# Altium project Receiver.PrjPcb (part 2 of 3)

## Sheet USB_Ethernet.SchDoc: USB & Ethernet
size A4; DrawnBy: Patrik Staudenmayer; DocumentNumber: 5; SheetNumber: 5; SheetTotal: 15
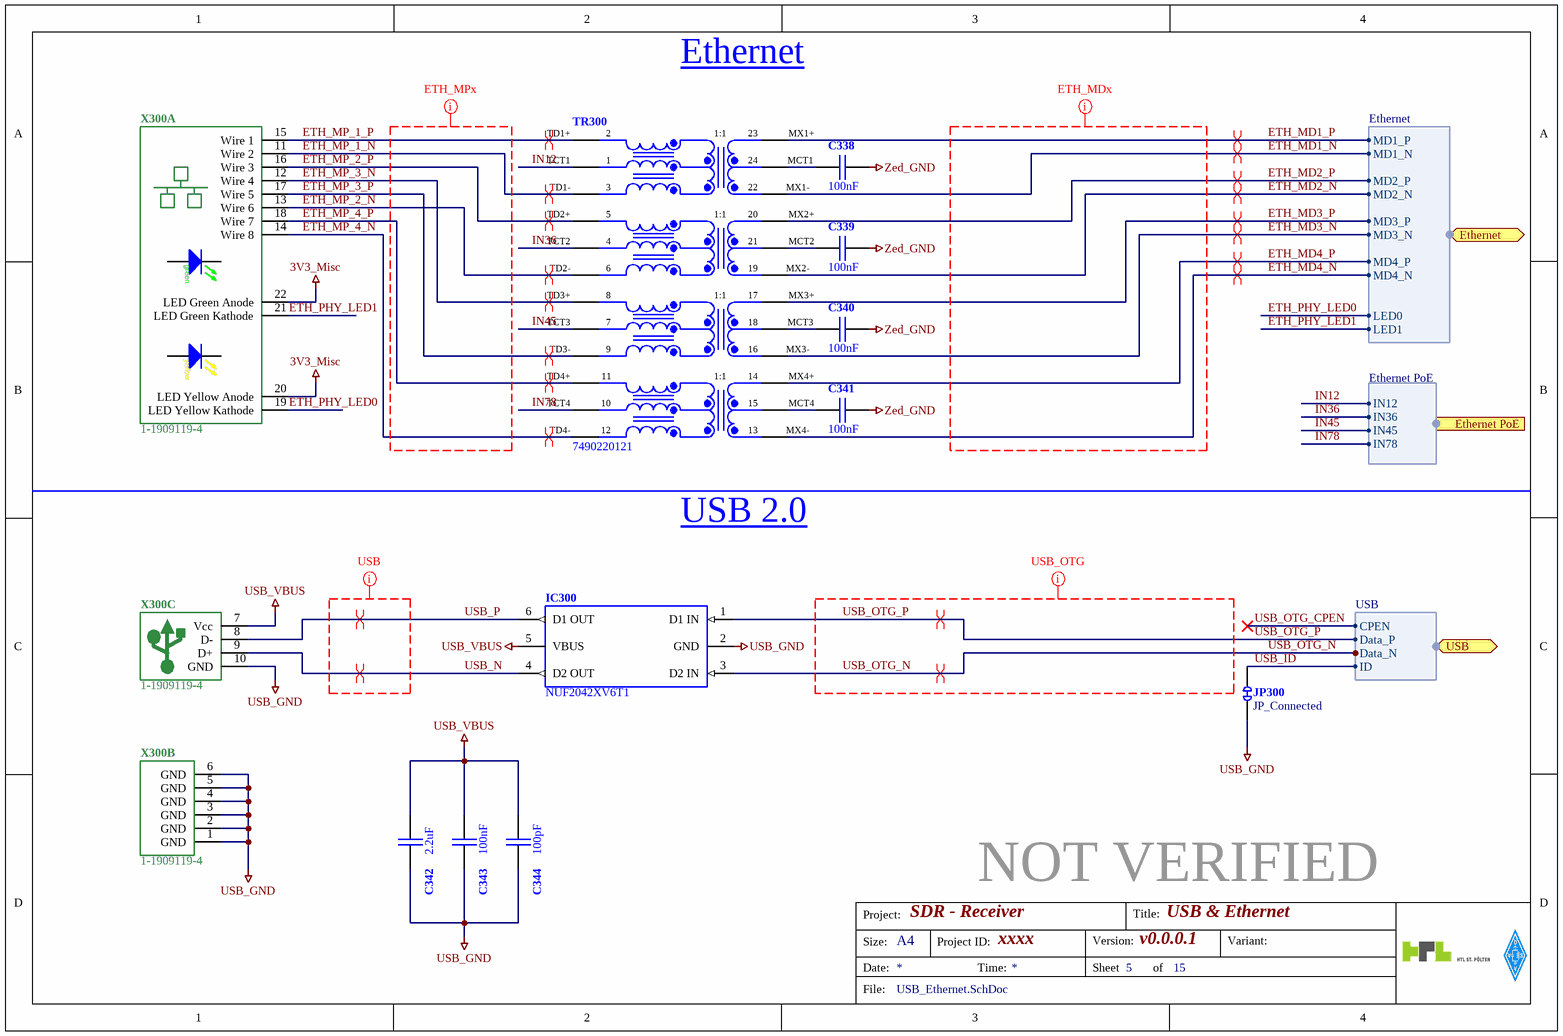
[diagram p6: USB_Ethernet.SchDoc]

### Parts
C338  100nF  [C_0603_N [CAPC1608N IPC]]
C339  100nF  [C_0603_N [CAPC1608N IPC]]
C340  100nF  [C_0603_N [CAPC1608N IPC]]
C341  100nF  [C_0603_N [CAPC1608N IPC]]
C342  2.2uF  [C_1210_N [CAPC3225N IPC]]
C343  100nF  [C_0805_N [CAPC2013N IPC]]
C344  100pF  [C_0603_N [CAPC1608N IPC]]
IC300  NUF2042XV6T1  [SOTFL50P160X60-6N IPC]
JP300  JP_Connected  [JP_Connected]  (no BOM)
TR300  7490220121  [TR_7490220121]
X300  1-1909119-4  [X_1-1909119-4]  (parts A,B,C of 3)

### Ports
Ethernet (bidir, harness Ethernet), Ethernet PoE (harness Ethernet PoE), USB (bidir, harness USB)

### Harnesses
Ethernet: LED0, LED1, MD1_P, MD1_N, MD2_P, MD2_N, MD3_P, MD3_N, MD4_P, MD4_N
Ethernet PoE: IN12, IN36, IN45, IN78
USB: ID, Data_P, Data_N, CPEN

### Nets
3V3_Misc: X300.20(LED_Yellow_Anode) X300.22(LED_Green_Anode)
USB_GND: C338.2 C339.2 C340.2 C341.2 C342.2 C343.2 C344.2 IC300.2(GND) JP300.2(-) X300.1(GND) X300.2(GND) X300.3(GND) X300.4(GND) X300.5(GND) X300.6(GND) X300.10(GND)  [also labelled Zed_GND]  [project net Con_GND]
USB_VBUS: C342.1 C343.1 C344.1 IC300.5(VBUS) X300.7(Vcc)
ETH_MD1_N: TR300.22(MX1-) ; port Ethernet.MD1_N
ETH_MD1_P: TR300.23(MX1+) ; port Ethernet.MD1_P
ETH_MD2_N: TR300.19(MX2-) ; port Ethernet.MD2_N
ETH_MD2_P: TR300.20(MX2+) ; port Ethernet.MD2_P
ETH_MD3_N: TR300.16(MX3-) ; port Ethernet.MD3_N
ETH_MD3_P: TR300.17(MX3+) ; port Ethernet.MD3_P
ETH_MD4_N: TR300.13(MX4-) ; port Ethernet.MD4_N
ETH_MD4_P: TR300.14(MX4+) ; port Ethernet.MD4_P
ETH_MP_1_N: TR300.3(TD1-) X300.11(Wire_2)
ETH_MP_1_P: TR300.2(TD1+) X300.15(Wire_1)
ETH_MP_2_N: TR300.6(TD2-) X300.13(Wire_6)
ETH_MP_2_P: TR300.5(TD2+) X300.16(Wire_3)
ETH_MP_3_N: TR300.8(TD3+) X300.12(Wire_4)
ETH_MP_3_P: TR300.9(TD3-) X300.17(Wire_5)
ETH_MP_4_N: TR300.12(TD4-) X300.14(Wire_8)
ETH_MP_4_P: TR300.11(TD4+) X300.18(Wire_7)
ETH_PHY_LED0: X300.19(LED_Yellow_Kathode) ; port Ethernet.LED0
ETH_PHY_LED1: X300.21(LED_Green_Kathode) ; port Ethernet.LED1
IN12: TR300.1(TCT1) ; port Ethernet PoE.IN12
IN36: TR300.4(TCT2) ; port Ethernet PoE.IN36
IN45: TR300.7(TCT3) ; port Ethernet PoE.IN45
IN78: TR300.10(TCT4) ; port Ethernet PoE.IN78
USB_ID: JP300.1(+) ; port USB.ID
USB_N: IC300.4(D2_OUT) X300.9(D+)
USB_OTG_CPEN: port USB.CPEN
USB_OTG_N: IC300.3(D2_IN) ; port USB.Data_N
USB_OTG_P: IC300.1(D1_IN) ; port USB.Data_P
USB_P: IC300.6(D1_OUT) X300.8(D-)
NetC338_1: C338.1 TR300.24(MCT1)
NetC339_1: C339.1 TR300.21(MCT2)
NetC340_1: C340.1 TR300.18(MCT3)
NetC341_1: C341.1 TR300.15(MCT4)

### Layout directives
differential pair: ETH_MD1_N, ETH_MD1_P, ETH_MD2_N, ETH_MD2_P, ETH_MD3_N, ETH_MD3_P, ETH_MD4_N, ETH_MD4_P, ETH_MP_1_N, ETH_MP_1_P, ETH_MP_2_N, ETH_MP_2_P, ETH_MP_3_N, ETH_MP_3_P, ETH_MP_4_N, ETH_MP_4_P, USB_N, USB_OTG_N, USB_OTG_P, USB_P
net class ETH_MDx; rule Matched Net Lengths [Tolerance = 25mil]; rule Maximum Via Count Constraint [Max Count = 2]; rule Differential Pairs Routing [Pref Gap = 5mil    Min Gap  = 5mil    Max Gap  = 5milPref Width = 4.138mil    Min Width  = 2.925mil    Max Width  = 4.138mil]: (no net found under the mark)
net class ETH_MPx; rule Matched Net Lengths [Tolerance = 25mil]; rule Maximum Via Count Constraint [Max Count = 2]; rule Differential Pairs Routing [Pref Gap = 5mil    Min Gap  = 5mil    Max Gap  = 5milPref Width = 4.138mil    Min Width  = 2.925mil    Max Width  = 4.138mil]: (no net found under the mark)
net class USB; rule Differential Pairs Routing [Pref Gap = 5mil    Min Gap  = 5mil    Max Gap  = 5milPref Width = 5.458mil    Min Width  = 3.981mil    Max Width  = 5.458mil]; rule Matched Net Lengths [Tolerance = 25mil]; rule Maximum Via Count Constraint [Max Count = 2]: (no net found under the mark)
net class USB_OTG; rule Differential Pairs Routing [Pref Gap = 5mil    Min Gap  = 5mil    Max Gap  = 5milPref Width = 5.458mil    Min Width  = 3.981mil    Max Width  = 5.458mil]; rule Matched Net Lengths [Tolerance = 25mil]; rule Maximum Via Count Constraint [Max Count = 2]: USB_OTG_N, USB_OTG_P

### Notes on the sheet
- Ethernet
- USB 2.0
- Project:
- Title:
- Size:
- Date:
- A4
- Project ID:
- Time:
- Sheet
- Version:
- of
- Variant:
- File:
- (in symbol TR_7490220121) 1:1
- (in symbol X_1-1909119-4, part A) green; yellow

### Library data of the parts
C338-C344 = C_GENERIC: Prometheus_ID: *; Prometheus_Manufacturer: *
  C338-C341: Prometheus_ManPartNo: 100nF; Prometheus_Comment: 100nF; Prometheus_CurrentFootprint: C_0603_N [CAPC1608N IPC]
  C342: Prometheus_ManPartNo: 2.2uF; Prometheus_Comment: 2.2uF; Prometheus_CurrentFootprint: C_1210_N [CAPC3225N IPC]
  C343: Prometheus_ManPartNo: 100nF; Prometheus_Comment: 100nF; Prometheus_CurrentFootprint: C_0805_N [CAPC2013N IPC]
  C344: Prometheus_ManPartNo: 100pF; Prometheus_Comment: 100pF; Prometheus_CurrentFootprint: C_0603_N [CAPC1608N IPC]
IC300 = IC_NUF2042XV6T1: USB Upstream Terminator with ESD Protection / Compliance with IEC61000-4-2 (Level 4) / 8 kV (Contact) / 15 kV (Air) / ESD Ratings: / Machine Model = C / Human Body Model = 3B; Prometheus_Manufacturer: ON Semiconductor; Prometheus_ManPartNo: NUF2042XV6T1; Prometheus_Comment: NUF2042XV6T1; Prometheus_CurrentFootprint: SOTFL50P160X60-6N IPC
TR300 = TR_7490220121: Operating temperature: -40°C - +105°C / 1000BaseT according to IEEE 802.3bt / for 4PPoE / 600 mA per center tap / 30 W when using two channels / 60 W when using four channels; Prometheus_Manufacturer: Wuerth; Prometheus_ID: *; Prometheus_ManPartNo: 7490220121; Prometheus_Comment: 7490220121; Prometheus_CurrentFootprint: TR_7490220121
X300 = X_1-1909119-4: Combo Jack RJ45 + USB / Green and Yellow Led; Prometheus_Manufacturer: TE Connectivity; Prometheus_ID: *; Prometheus_ManPartNo: 1-1909119-4; Prometheus_Comment: 1-1909119-4; Prometheus_CurrentFootprint: X_1-1909119-4
JP300 = JP_Connected: Prometheus_ID: *; Prometheus_ManPartNo: JP_Connected; Prometheus_Manufacturer: *; Prometheus_Comment: JP_Connected; Prometheus_CurrentFootprint: JP_Connected

## Sheet SD_Card.SchDoc: SD Card
size A4; DrawnBy: Patrik Staudenmayer; DocumentNumber: 6; SheetNumber: 6; SheetTotal: 15
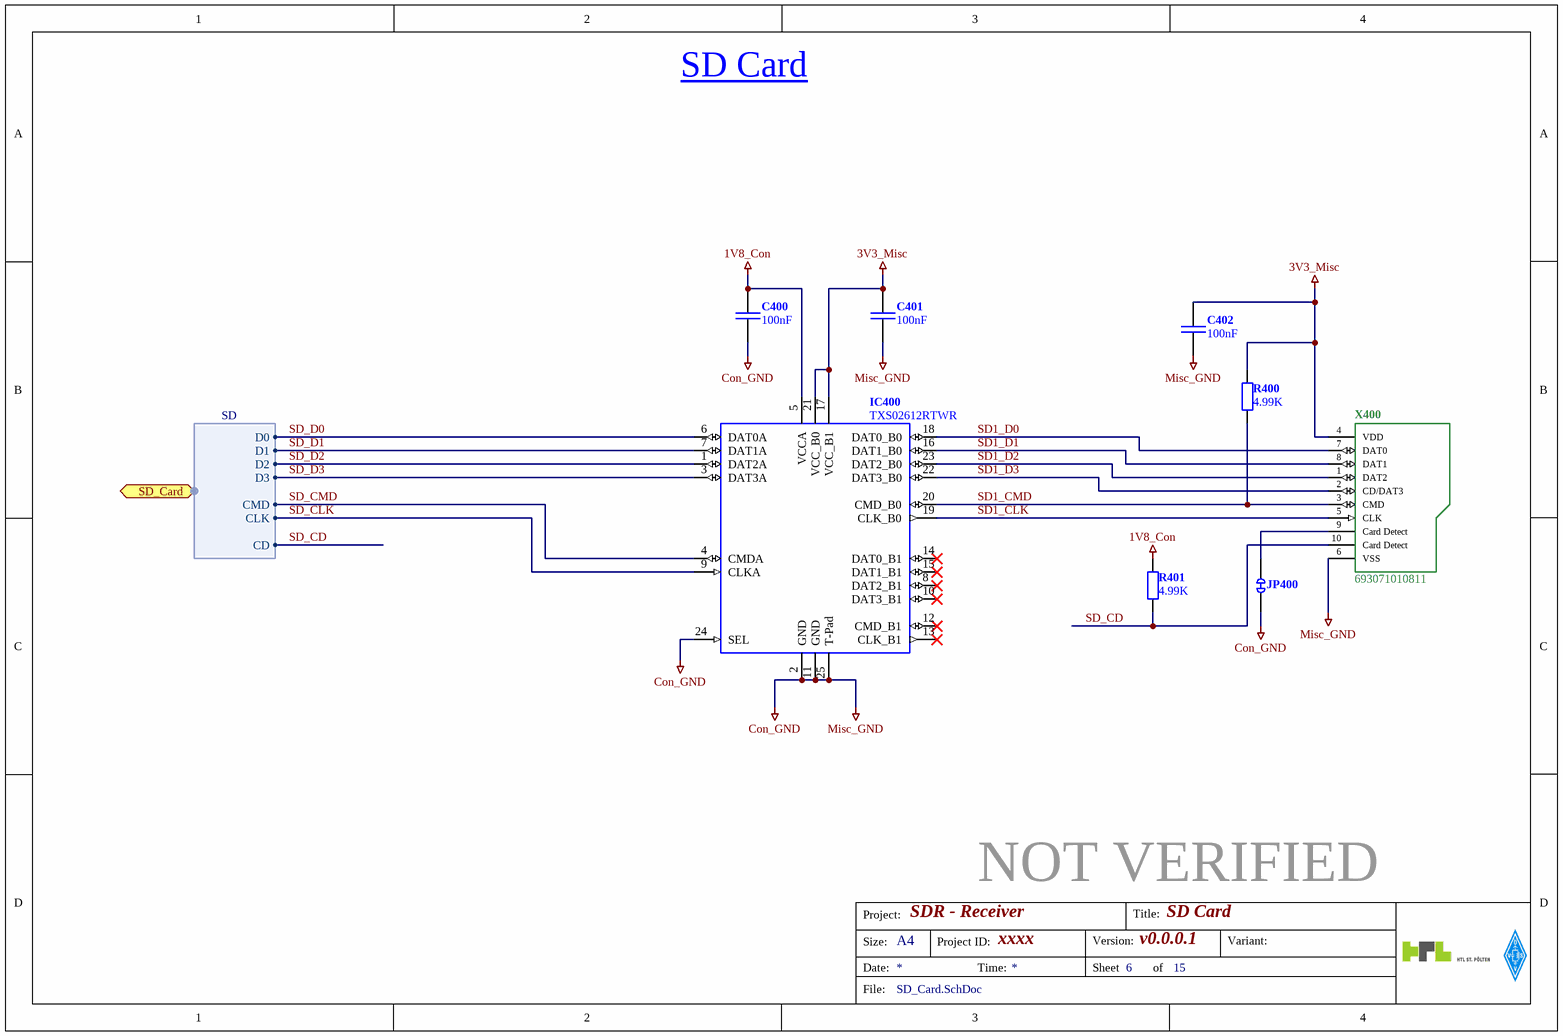
[diagram p7: SD_Card.SchDoc]

### Parts
C400  100nF  [C_0603_N [CAPC1608N IPC]]
C401  100nF  [C_0603_N [CAPC1608N IPC]]
C402  100nF  [C_0603_N [CAPC1608N IPC]]
IC400  TXS02612RTWR  [QFN50P400X400X80_HS-25N IPC]
JP400  JP_Connected  [JP_Connected]  (value not drawn)  (no BOM)
R400  4.99K  [R_0603_N [RESC1608N IPC]]
R401  4.99K  [R_0603_N [RESC1608N IPC]]
X400  693071010811  [X_693071010811]

### Ports
SD_Card (bidir, harness SD)

### Harnesses
SD: CLK, D0, D1, D2, D3, CD, CMD

### Nets
1V8_Con: C400.1 IC400.5(VCCA) R401.2
3V3_Misc: C401.1 C402.1 IC400.17(VCC_B1) IC400.21(VCC_B0) R400.2 X400.4(VDD)
Con_GND: C400.2 C401.2 C402.2 IC400.2(GND) IC400.11(GND) IC400.24(SEL) IC400.25(T-Pad) JP400.2(-) X400.6(VSS)  [also labelled Misc_GND]
SD1_CLK: IC400.19(CLK_B0) X400.5(CLK)
SD1_CMD: IC400.20(CMD_B0) R400.1 X400.3(CMD)
SD1_D0: IC400.18(DAT0_B0) X400.7(DAT0)
SD1_D1: IC400.16(DAT1_B0) X400.8(DAT1)
SD1_D2: IC400.23(DAT2_B0) X400.1(DAT2)
SD1_D3: IC400.22(DAT3_B0) X400.2(CD/DAT3)
SD_CD: R401.1 X400.10(Card_Detect) ; port SD_Card.CD
SD_CLK: IC400.9(CLKA) ; port SD_Card.CLK
SD_CMD: IC400.4(CMDA) ; port SD_Card.CMD
SD_D0: IC400.6(DAT0A) ; port SD_Card.D0
SD_D1: IC400.7(DAT1A) ; port SD_Card.D1
SD_D2: IC400.1(DAT2A) ; port SD_Card.D2
SD_D3: IC400.3(DAT3A) ; port SD_Card.D3
NetJP400_1: JP400.1(+) X400.9(Card_Detect)

Not connected (* = marked no-connect by the designer): IC400 8(DAT2_B1)* 10(DAT3_B1)* 12(CMD_B1)* 13(CLK_B1)* 14(DAT0_B1)* 15(DAT1_B1)*

### Notes on the sheet
- SD Card
- Project:
- Title:
- Size:
- Date:
- A4
- Project ID:
- Time:
- Sheet
- Version:
- of
- Variant:
- File:

### Library data of the parts
C400-C402 = C_GENERIC: Prometheus_ID: *; Prometheus_ManPartNo: 100nF; Prometheus_Manufacturer: *; Prometheus_Comment: 100nF; Prometheus_CurrentFootprint: C_0603_N [CAPC1608N IPC]
IC400 = IC_TXS02612: Prometheus_Manufacturer: Analog Devices; Prometheus_ManPartNo: TXS02612RTWR; Prometheus_Comment: TXS02612RTWR; Prometheus_CurrentFootprint: QFN50P400X400X80_HS-25N IPC
R400 R401 = R_GENERIC_DIN: Prometheus_ID: *; Prometheus_ManPartNo: 4.99K; Prometheus_Manufacturer: *; Prometheus_Comment: 4.99K; Prometheus_CurrentFootprint: R_0603_N [RESC1608N IPC]
X400 = X_693071010811: WR-CRD Micro SD Card Connector, Push & Push, with card detection; Prometheus_Manufacturer: Wuerth Electronics; Prometheus_ID: *; Prometheus_ManPartNo: 693071010811; Prometheus_Comment: 693071010811; Prometheus_CurrentFootprint: X_693071010811
JP400 = JP_Connected: Prometheus_ID: *; Prometheus_ManPartNo: JP_Connected; Prometheus_Manufacturer: *; Prometheus_Comment: JP_Connected; Prometheus_CurrentFootprint: JP_Connected

## Sheet UART_JTAG.SchDoc: UART & JTAG
size A4; DrawnBy: Patrik Staudenmayer; DocumentNumber: 7; SheetNumber: 7; SheetTotal: 15
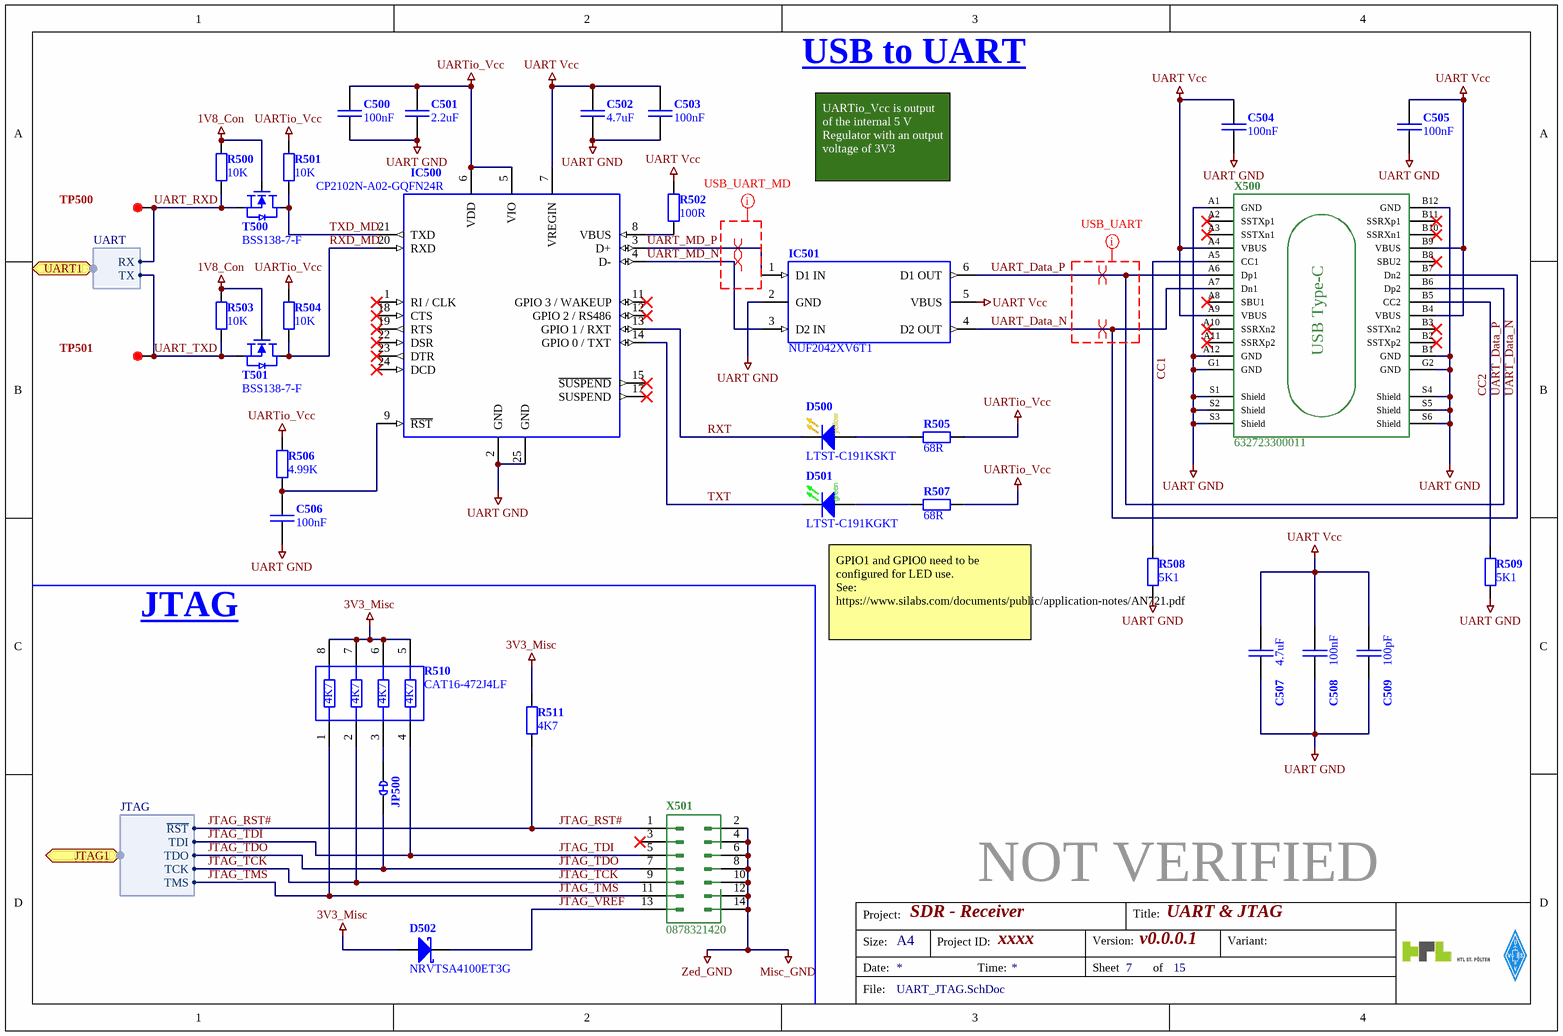
[diagram p8: UART_JTAG.SchDoc]

### Parts
C500  100nF  [C_0603_N [CAPC1608N IPC]]
C501  2.2uF  [C_0805_N [CAPC2013N IPC]]
C502  4.7uF  [C_0805_N [CAPC2013N IPC]]
C503  100nF  [C_0603_N [CAPC1608N IPC]]
C504  100nF  [C_0603_N [CAPC1608N IPC]]
C505  100nF  [C_0603_N [CAPC1608N IPC]]
C506  100nF  [C_0603_N [CAPC1608N IPC]]
C507  4.7uF  [C_1210_N [CAPC3225N IPC]]
C508  100nF  [C_0805_N [CAPC2013N IPC]]
C509  100pF  [C_0603_N [CAPC1608N IPC]]
D500  LTST-C191KSKT  [LED_0603-YELLOW_N_AK]
D501  LTST-C191KGKT  [LED_0603-GREEN_N_AK]
D502  NRVTSA4100ET3G  [DIOM4326X22N IPC]
IC500  CP2102N-A02-GQFN24R  [QFN50P400X400X80_HS-25N IPC]
IC501  NUF2042XV6T1  [SOTFL50P160X60-6N IPC]
JP500  JP_Connected  [JP_Connected]  (value not drawn)  (no BOM)
R500  10K  [R_0201_L [RESC0603L IPC]]
R501  10K  [R_0201_L [RESC0603L IPC]]
R502  100R  [R_0603_N [RESC1608N IPC]]
R503  10K  [R_0201_L [RESC0603L IPC]]
R504  10K  [R_0201_L [RESC0603L IPC]]
R505  68R  [R_0603_N [RESC1608N IPC]]
R506  4.99K  [R_0201_L [RESC0603L IPC]]
R507  68R  [R_0603_N [RESC1608N IPC]]
R508  5K1  [R_0603_N [RESC1608N IPC]]
R509  5K1  [R_0603_N [RESC1608N IPC]]
R510  CAT16-472J4LF  [CAC-80P320X155-8N]
R511  4K7  [R_0603_N [RESC1608N IPC]]
T500  BSS138-7-F  [SOT105P235X102-3N IPC]
T501  BSS138-7-F  [SOT105P235X102-3N IPC]
TP500  TP_GENERIC  [TP_0.8_P100T]  (value not drawn)  (no BOM)
TP501  TP_GENERIC  [TP_0.8_P100T]  (value not drawn)  (no BOM)
X500  632723300011  [X_632723300011]
X501  0878321420  [X_SMD_HEADER2x7_P254_H0_Prometheus]

### Ports
JTAG1 (bidir, harness JTAG), UART1 (bidir, harness UART)

### Harnesses
UART: RX, TX
JTAG: TMS, TCK, TDI, TDO, ~{RST}

### Nets
1V8_Con: R500.2 R503.2 T500.G T501.G
3V3_Misc: D502.A R510.5 R510.6 R510.7 R510.8 R511.2
Misc_GND: X501.2 X501.4 X501.6 X501.8 X501.10 X501.12 X501.14  [also labelled Zed_GND]  [project net Con_GND]
UART GND: C500.2 C501.2 C502.2 C503.2 C504.2 C505.2 C506.2 C507.2 C508.2 C509.2 IC500.2(GND) IC500.25(GND) IC501.2(GND) R508.1 R509.1 X500.A1(GND) X500.A12(GND) X500.B1(GND) X500.B12(GND) X500.G1(GND) X500.G2(GND) X500.S1(Shield) X500.S2(Shield) X500.S3(Shield) X500.S4(Shield) X500.S5(Shield) X500.S6(Shield)
UART Vcc: C502.1 C503.1 C504.1 C505.1 C507.1 C508.1 C509.1 IC500.7(VREGIN) IC501.5(VBUS) R502.1 X500.A4(VBUS) X500.A9(VBUS) X500.B4(VBUS) X500.B9(VBUS)
UARTio_Vcc: C500.1 C501.1 IC500.5(VIO) IC500.6(VDD) R501.2 R504.2 R505.1 R506.2 R507.1
CC1: R508.2 X500.A5(CC1)
CC2: R509.2 X500.B5(CC2)
JTAG_RST#: R511.1 X501.1 ; port JTAG1.~{RST}
JTAG_TCK: R510.2 X501.9 ; port JTAG1.TCK
JTAG_TDI: R510.4 X501.5 ; port JTAG1.TDI
JTAG_TDO: JP500.2(-) X501.7 ; port JTAG1.TDO
JTAG_TMS: R510.1 X501.11 ; port JTAG1.TMS
JTAG_VREF: D502.K X501.13
RXD_MD: IC500.20(RXD) R504.1 T501.D
RXT: D500.K IC500.13(GPIO_1_/_RXT)
TXD_MD: IC500.21(TXD) R501.1 T500.D
TXT: D501.K IC500.14(GPIO_0_/_TXT)
UART_Data_N: IC501.4(D2_OUT) X500.A7(Dn1) X500.B7(Dn2)
UART_Data_P: IC501.6(D1_OUT) X500.A6(Dp1) X500.B6(Dp2)
UART_MD_N: IC500.4(D-) IC501.3(D2_IN)
UART_MD_P: IC500.3(D+) IC501.1(D1_IN)
UART_RXD: R500.1 T500.S TP500.1 ; port UART1.RX
UART_TXD: R503.1 T501.S TP501.1 ; port UART1.TX
NetC506_1: C506.1 IC500.9(~{RST}) R506.1
NetD500_A: D500.A R505.2
NetD501_A: D501.A R507.2
NetIC500_8: IC500.8(VBUS) R502.2
NetJP500_1: JP500.1(+) R510.3

Not connected (* = marked no-connect by the designer): IC500 1(RI_/_CLK)* 11(GPIO_3_/_WAKEUP)* 12(GPIO_2_/_RS486)* 15(~{SUSPEND})* 17(SUSPEND)* 18(CTS)* 19(RTS)* 22(DSR)* 23(DTR)* 24(DCD)*; X500 A2(SSTXp1)* A3(SSTXn1)* A8(SBU1)* A10(SSRXn2)* A11(SSRXp2)* B2(SSTXp2)* B3(SSTXn2)* B8(SBU2)* B10(SSRXn1)* B11(SSRXp1)*; X501 3*

### Layout directives
rule Differential Pairs Routing [Pref Gap = 5mil    Min Gap  = 5mil    Max Gap  = 5milPref Width = 5.458mil    Min Width  = 3.981mil    Max Width  = 5.458mil]; rule Maximum Via Count Constraint [Max Count = 2]; rule Matched Net Lengths [Tolerance = 25mil]: (no net found under the mark)
differential pair: UART_Data_N, UART_Data_P, UART_MD_N, UART_MD_P

### Notes on the sheet
- USB to UART
- UARTio_Vcc is output of the internal 5 V Regulator with an output voltage of 3V3
- JTAG
- GPIO1 and GPIO0 need to be configured for LED use.
  See: https://www.silabs.com/documents/public/application-notes/AN721.pdf
- Project:
- Title:
- Size:
- Date:
- A4
- Project ID:
- Time:
- Sheet
- Version:
- of
- Variant:
- File:
- (in symbol LED_GREEN_GENERIC) green
- (in symbol LED_YELLOW_GENERIC) yellow
- (in symbol R_CAT16-472J4LF) 4K7
- (in symbol X_632723300011) USB Type-C

### Library data of the parts
C500-C509 = C_GENERIC: Prometheus_ID: *; Prometheus_Manufacturer: *
  C500 C503-C506: Prometheus_ManPartNo: 100nF; Prometheus_Comment: 100nF; Prometheus_CurrentFootprint: C_0603_N [CAPC1608N IPC]
  C501: Prometheus_ManPartNo: 2.2uF; Prometheus_Comment: 2.2uF; Prometheus_CurrentFootprint: C_0805_N [CAPC2013N IPC]
  C502: Prometheus_ManPartNo: 4.7uF; Prometheus_Comment: 4.7uF; Prometheus_CurrentFootprint: C_0805_N [CAPC2013N IPC]
  C507: Prometheus_ManPartNo: 4.7uF; Prometheus_Comment: 4.7uF; Prometheus_CurrentFootprint: C_1210_N [CAPC3225N IPC]
  C508: Prometheus_ManPartNo: 100nF; Prometheus_Comment: 100nF; Prometheus_CurrentFootprint: C_0805_N [CAPC2013N IPC]
  C509: Prometheus_ManPartNo: 100pF; Prometheus_Comment: 100pF; Prometheus_CurrentFootprint: C_0603_N [CAPC1608N IPC]
D500 = LED_YELLOW_GENERIC: Prometheus_ID: *; Prometheus_ManPartNo: LTST-C191KSKT; Prometheus_Manufacturer: *; Prometheus_Comment: LTST-C191KSKT; Prometheus_CurrentFootprint: LED_0603-YELLOW_N_AK; ComponentLink1Description: Datasheet; ComponentLink1URL: https://optoelectronics.liteon.com/upload/download/DS22-2000-224/LTST-C191KSKT.PDF
D501 = LED_GREEN_GENERIC: Prometheus_Manufacturer: Lite-On Inc.; Prometheus_ID: *; Prometheus_ManPartNo: LTST-C191KGKT; Prometheus_Comment: LTST-C191KGKT; Prometheus_CurrentFootprint: LED_0603-GREEN_N_AK; ComponentLink1Description: Datasheet; ComponentLink1URL: https://optoelectronics.liteon.com/upload/download/DS22-2000-228/LTST-C191KGKT.PDF
D502 = D_SCHOTTKY_NRVTSA4100E: max. Vr = 100 V / max Vf = 680 mV; Prometheus_Manufacturer: ON Semiconductor; Prometheus_ID: *; Prometheus_ManPartNo: NRVTSA4100ET3G; Prometheus_Comment: NRVTSA4100ET3G; Prometheus_CurrentFootprint: DIOM4326X22N IPC
IC500 = IC_CP2102N: USB to UART Data Transfer / USB 2.0 compliant; full speed (12Mbps) / Single power supply of 3.0 to 3.6 V or 3.0 to 5.25 V / Virtual COM Port Device Drivers; Prometheus_Manufacturer: Silabs; Prometheus_ManPartNo: CP2102N-A02-GQFN24R; Prometheus_Comment: CP2102N-A02-GQFN24R; Prometheus_CurrentFootprint: QFN50P400X400X80_HS-25N IPC
IC501 = IC_NUF2042XV6T1: USB Upstream Terminator with ESD Protection / Compliance with IEC61000-4-2 (Level 4) / 8 kV (Contact) / 15 kV (Air) / ESD Ratings: / Machine Model = C / Human Body Model = 3B; Prometheus_Manufacturer: ON Semiconductor; Prometheus_ManPartNo: NUF2042XV6T1; Prometheus_Comment: NUF2042XV6T1; Prometheus_CurrentFootprint: SOTFL50P160X60-6N IPC
R500-R509 R511 = R_GENERIC_DIN: Prometheus_ID: *; Prometheus_Manufacturer: *
  R500 R501 R503 R504: Prometheus_ManPartNo: 10K; Prometheus_Comment: 10K; Prometheus_CurrentFootprint: R_0201_L [RESC0603L IPC]
  R502: Prometheus_ManPartNo: 100R; Prometheus_Comment: 100R; Prometheus_CurrentFootprint: R_0603_N [RESC1608N IPC]
  R505 R507: Prometheus_ManPartNo: 68R; Prometheus_Comment: 68R; Prometheus_CurrentFootprint: R_0603_N [RESC1608N IPC]
  R506: Prometheus_ManPartNo: 4.99K; Prometheus_Comment: 4.99K; Prometheus_CurrentFootprint: R_0201_L [RESC0603L IPC]
  R508 R509: Prometheus_ManPartNo: 5K1; Prometheus_Comment: 5K1; Prometheus_CurrentFootprint: R_0603_N [RESC1608N IPC]
  R511: Prometheus_ManPartNo: 4K7; Prometheus_Comment: 4K7; Prometheus_CurrentFootprint: R_0603_N [RESC1608N IPC]
R510 = R_CAT16-472J4LF: Resitor array 4 x 4K7 1206; Prometheus_Manufacturer: Bourns Inc.; Prometheus_ID: *; Prometheus_ManPartNo: CAT16-472J4LF; Prometheus_Comment: CAT16-472J4LF; Prometheus_CurrentFootprint: CAC-80P320X155-8N
T500 T501 = T_NMOS_BSS138-7-F: VDS = 50 V / VDG = 50 V / VGS = +-20 V / ID = 200 mA / VGS_th = typ. 1.2 V / RDS_on = typ. 1.4 OHM; Prometheus_Manufacturer: Diodes Incorporated; Prometheus_ID: *; Prometheus_ManPartNo: BSS138-7-F; Prometheus_Comment: BSS138-7-F; Prometheus_CurrentFootprint: SOT105P235X102-3N IPC; ComponentLink1Description: Datasheet; ComponentLink1URL: https://www.diodes.com/assets/Datasheets/ds30144.pdf
TP500 TP501 = TP_GENERIC: Needle Test Point; Prometheus_ID: *; Prometheus_ManPartNo: TP_GENERIC; Prometheus_Manufacturer: *; Prometheus_Comment: TP_GENERIC; Prometheus_CurrentFootprint: TP_0.8_P100T
X500 = X_632723300011: USB Type-C Receptabel / Horizontal / 1.6 mm PCB thickness; Prometheus_Manufacturer: Wuerth Electronics; Prometheus_ID: *; Prometheus_ManPartNo: 632723300011; Prometheus_Comment: 632723300011; Prometheus_CurrentFootprint: X_632723300011
X501 = X_HEADER_SMD_7x2_RM2.54: Pin-Header RM2.54, straight, 7pin, dual row; Prometheus_Manufacturer: Molex; Prometheus_ID: *; Prometheus_ManPartNo: 0878321420; Prometheus_Comment: 0878321420; Prometheus_CurrentFootprint: X_SMD_HEADER2x7_P254_H0_Prometheus
JP500 = JP_Connected: Prometheus_ID: *; Prometheus_ManPartNo: JP_Connected; Prometheus_Manufacturer: *; Prometheus_Comment: JP_Connected; Prometheus_CurrentFootprint: JP_Connected

## Sheet HF_FrontEndOverview.SchDoc: HF Front End
size A4; DrawnBy: Patrik Staudenmayer; DocumentNumber: 9; SheetNumber: 9; SheetTotal: 15
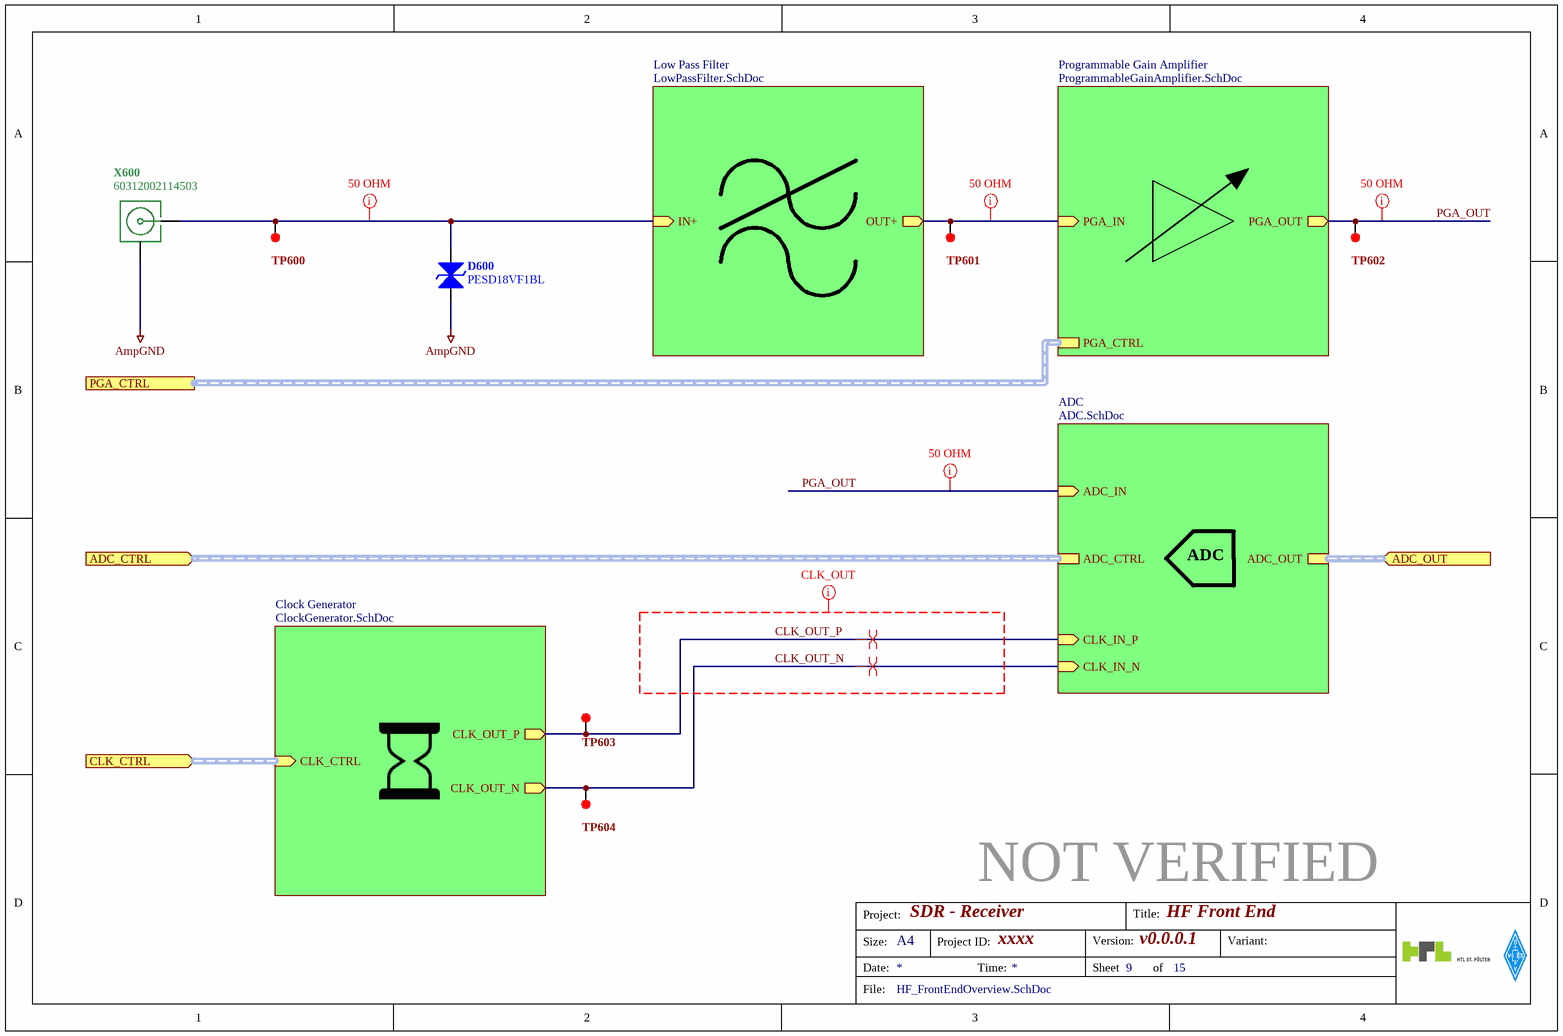
[diagram p9: HF_FrontEndOverview.SchDoc]

### Parts
D600  PESD18VF1BL  [DFN65P98X50-2N IPC]
TP600  TP_GENERIC  [TP_0.8_P100T]  (value not drawn)  (no BOM)
TP601  TP_GENERIC  [TP_0.8_P100T]  (value not drawn)  (no BOM)
TP602  TP_GENERIC  [TP_0.8_P100T]  (value not drawn)  (no BOM)
TP603  TP_GENERIC  [TP_0.8_P100T]  (value not drawn)  (no BOM)
TP604  TP_GENERIC  [TP_0.8_P100T]  (value not drawn)  (no BOM)
X600  60312002114503  [X_60312002114503]

### Sub-sheets
ADC = ADC.SchDoc: ADC_OUT (harness ADC_OUT), CLK_IN_N (in), CLK_IN_P (in), ADC_CTRL (harness ADC_CTRL), ADC_IN (in)
Clock Generator = ClockGenerator.SchDoc: CLK_OUT_P (out), CLK_CTRL (in, harness CLK_CTRL), CLK_OUT_N (out)
Low Pass Filter = LowPassFilter.SchDoc: OUT+ (out), IN+ (in)
Programmable Gain Amplifier = ProgrammableGainAmplifier.SchDoc: PGA_IN (in), PGA_OUT (out), PGA_CTRL (harness PGA_CTRL)

### Ports
ADC_CTRL (in, harness ADC_CTRL), ADC_OUT (in, harness ADC_OUT), CLK_CTRL (in, harness CLK_CTRL), PGA_CTRL (harness PGA_CTRL)

### Nets
AmpGND: D600.2 X600.2(GND)
CLK_OUT_N: TP604.1 ; sheet ADC/CLK_IN_N, sheet Clock Generator/CLK_OUT_N
CLK_OUT_P: TP603.1 ; sheet ADC/CLK_IN_P, sheet Clock Generator/CLK_OUT_P
PGA_OUT: TP602.1 ; sheet Programmable Gain Amplifier/PGA_OUT, sheet ADC/ADC_IN
NetD600_1: D600.1 TP600.1 X600.1(Sig) ; sheet Low Pass Filter/IN+
NetTP601_1: TP601.1 ; sheet Low Pass Filter/OUT+, sheet Programmable Gain Amplifier/PGA_IN

### Buses and harness runs
harness port ADC_CTRL = sheet ADC/ADC_CTRL
harness port ADC_OUT = sheet ADC/ADC_OUT
harness port CLK_CTRL = sheet Clock Generator/CLK_CTRL
harness port PGA_CTRL = sheet Programmable Gain Amplifier/PGA_CTRL

### Layout directives
rule Width Constraint [Pref Impedance = 50.00ohms    Min Impedance = 50.00ohms    Max Impedance = 50.00ohms]; rule Maximum Via Count Constraint [Max Count = 2]: NetD600_1, NetTP601_1, PGA_OUT
differential pair: CLK_OUT_N, CLK_OUT_P
net class CLK_OUT; rule Differential Pairs Routing [Pref Gap = 5mil    Min Gap  = 5mil    Max Gap  = 5milPref Width = 4.138mil    Min Width  = 2.925mil    Max Width  = 4.138mil]; rule Maximum Via Count Constraint [Max Count = 2]; rule Matched Net Lengths [Tolerance = 25mil]: CLK_OUT_N, CLK_OUT_P

### Notes on the sheet
- ADC
- Project:
- Title:
- Size:
- Date:
- A4
- Project ID:
- Time:
- Sheet
- Version:
- of
- Variant:
- File:

### Library data of the parts
D600 = D_TVS_PESD18VF1BL: Ultra low capacitance bidirectional ESD protection diode / Cd = 0.35 pF @ 1 MHz / Reverse standoff voltage Vrwm = 18 V @ 25 °C; Prometheus_Manufacturer: Nexperia; Prometheus_ID: *; Prometheus_ManPartNo: PESD18VF1BL; Prometheus_Comment: PESD18VF1BL; Prometheus_CurrentFootprint: DFN65P98X50-2N IPC; DatasheetURL: https://assets.nexperia.com/documents/data-sheet/PESD18VF1BL.pdf
TP600-TP604 = TP_GENERIC: Needle Test Point; Prometheus_ID: *; Prometheus_ManPartNo: TP_GENERIC; Prometheus_Manufacturer: *; Prometheus_Comment: TP_GENERIC; Prometheus_CurrentFootprint: TP_0.8_P100T
X600 = X_60312002114503: SMA Jack Straight / Type: 348; Prometheus_Manufacturer: Wuerth Electronics; Prometheus_ID: *; Prometheus_ManPartNo: 60312002114503; Prometheus_Comment: 60312002114503; Prometheus_CurrentFootprint: X_60312002114503

## Sheet LowPassFilter.SchDoc: Low Pass Filter
size A4; DrawnBy: Patrik Staudenmayer; DocumentNumber: 12; SheetNumber: 12; SheetTotal: 15
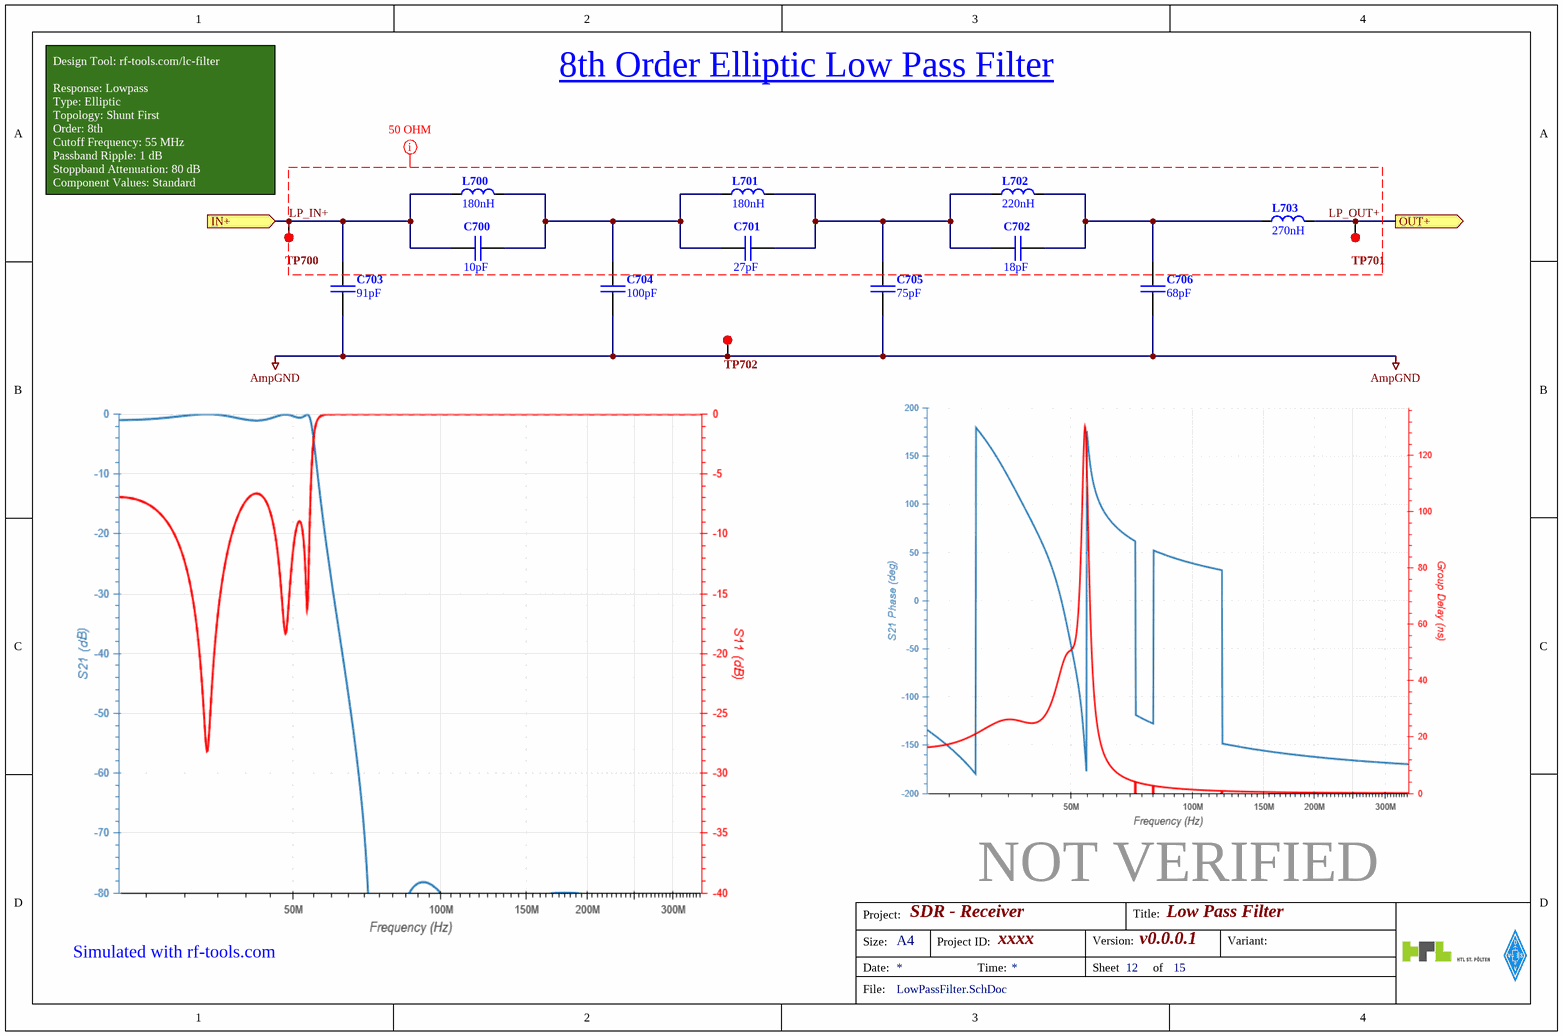
[diagram p10: LowPassFilter.SchDoc]

### Parts
C700  10pF  [C_0603_N [CAPC1608N IPC]]
C701  27pF  [C_0603_N [CAPC1608N IPC]]
C702  18pF  [C_0603_N [CAPC1608N IPC]]
C703  91pF  [C_0603_N [CAPC1608N IPC]]
C704  100pF  [C_0603_N [CAPC1608N IPC]]
C705  75pF  [C_0603_N [CAPC1608N IPC]]
C706  68pF  [C_0603_N [CAPC1608N IPC]]
L700  180nH  [L_0603_N [INDC1608N IPC]]
L701  180nH  [L_0603_N [INDC1608N IPC]]
L702  220nH  [L_0603_N [INDC1608N IPC]]
L703  270nH  [L_0603_N [INDC1608N IPC]]
TP700  TP_GENERIC  [TP_0.8_P100T]  (value not drawn)  (no BOM)
TP701  TP_GENERIC  [TP_0.8_P100T]  (value not drawn)  (no BOM)
TP702  TP_GENERIC  [TP_0.8_P100T]  (value not drawn)  (no BOM)

### Ports
IN+ (in), OUT+ (out)

### Nets
AmpGND: C703.1 C704.1 C705.1 C706.1 TP702.1
LP_IN+: C700.1 C703.2 L700.1 TP700.1 ; port IN+
LP_OUT+: L703.2 TP701.1 ; port OUT+
NetC700_2: C700.2 C701.1 C704.2 L700.2 L701.1
NetC701_2: C701.2 C702.1 C705.2 L701.2 L702.1
NetC702_2: C702.2 C706.2 L702.2 L703.1

### Layout directives
net class Filter; rule Width Constraint [Pref Impedance = 50.00ohms    Min Impedance = 50.00ohms    Max Impedance = 50.00ohms]: LP_IN+, LP_OUT+

### Notes on the sheet
- 8th Order Elliptic Low Pass Filter
- (near TP700) Design Tool: rf-tools.com/lc-filter
  Response: Lowpass
  Type: Elliptic
  Topology: Shunt First
  Order: 8th
  Cutoff Frequency: 55 MHz
  Passband Ripple: 1 dB
  Stoppband Attenuation: 80 dB
  Component Values: Standard
- Simulated with rf-tools.com
- Project:
- Title:
- Size:
- Date:
- A4
- Project ID:
- Time:
- Sheet
- Version:
- of
- Variant:
- File:

### Library data of the parts
C700 = C_GENERIC: Prometheus_Manufacturer: AVX Corporation; Prometheus_ID: 06031U100FAT2A; Prometheus_ManPartNo: 10pF; Prometheus_Comment: 10pF; Prometheus_CurrentFootprint: C_0603_N [CAPC1608N IPC]
C701 = C_GENERIC: Prometheus_Manufacturer: AVX Corporation; Prometheus_ID: 06031U270FAT2A; Prometheus_ManPartNo: 27pF; Prometheus_Comment: 27pF; Prometheus_CurrentFootprint: C_0603_N [CAPC1608N IPC]
C702 = C_GENERIC: Prometheus_Manufacturer: AVX Corporation; Prometheus_ID: 06031U180FAT2A; Prometheus_ManPartNo: 18pF; Prometheus_Comment: 18pF; Prometheus_CurrentFootprint: C_0603_N [CAPC1608N IPC]
C703 = C_GENERIC: Prometheus_Manufacturer: AVX Corporation; Prometheus_ID: 06031U910FAT2A; Prometheus_ManPartNo: 91pF; Prometheus_Comment: 91pF; Prometheus_CurrentFootprint: C_0603_N [CAPC1608N IPC]
C704 = C_GENERIC: Prometheus_Manufacturer: AVX Corporation; Prometheus_ID: 06031U101FAT2A; Prometheus_ManPartNo: 100pF; Prometheus_Comment: 100pF; Prometheus_CurrentFootprint: C_0603_N [CAPC1608N IPC]
C705 = C_GENERIC: Prometheus_Manufacturer: AVX Corporation; Prometheus_ID: 06031U750FAT2A; Prometheus_ManPartNo: 75pF; Prometheus_Comment: 75pF; Prometheus_CurrentFootprint: C_0603_N [CAPC1608N IPC]
C706 = C_GENERIC: Prometheus_Manufacturer: AVX Corporation; Prometheus_ID: 06031U680FAT2A; Prometheus_ManPartNo: 68pF; Prometheus_Comment: 68pF; Prometheus_CurrentFootprint: C_0603_N [CAPC1608N IPC]
L700 L701 = L_GENERIC: Prometheus_ManPartNo: 744761218C; Prometheus_Manufacturer: Wuerth Electronics; Prometheus_ID: *; Prometheus_Comment: 180nH; Prometheus_CurrentFootprint: L_0603_N [INDC1608N IPC]
L702 = L_GENERIC: Prometheus_ManPartNo: 744761222C; Prometheus_Manufacturer: Wuerth Electronics; Prometheus_ID: *; Prometheus_Comment: 220nH; Prometheus_CurrentFootprint: L_0603_N [INDC1608N IPC]
L703 = L_GENERIC: Prometheus_ManPartNo: 744761227C; Prometheus_Manufacturer: Wuerth Electronics; Prometheus_ID: *; Prometheus_Comment: 270nH; Prometheus_CurrentFootprint: L_0603_N [INDC1608N IPC]
TP700-TP702 = TP_GENERIC: Needle Test Point; Prometheus_ID: *; Prometheus_ManPartNo: TP_GENERIC; Prometheus_Manufacturer: *; Prometheus_Comment: TP_GENERIC; Prometheus_CurrentFootprint: TP_0.8_P100T

## Sheet ProgrammableGainAmplifier.SchDoc: Programmable Gain Amplifier
size A4; DrawnBy: Patrik Staudenmayer; DocumentNumber: 13; SheetNumber: 13; SheetTotal: 15
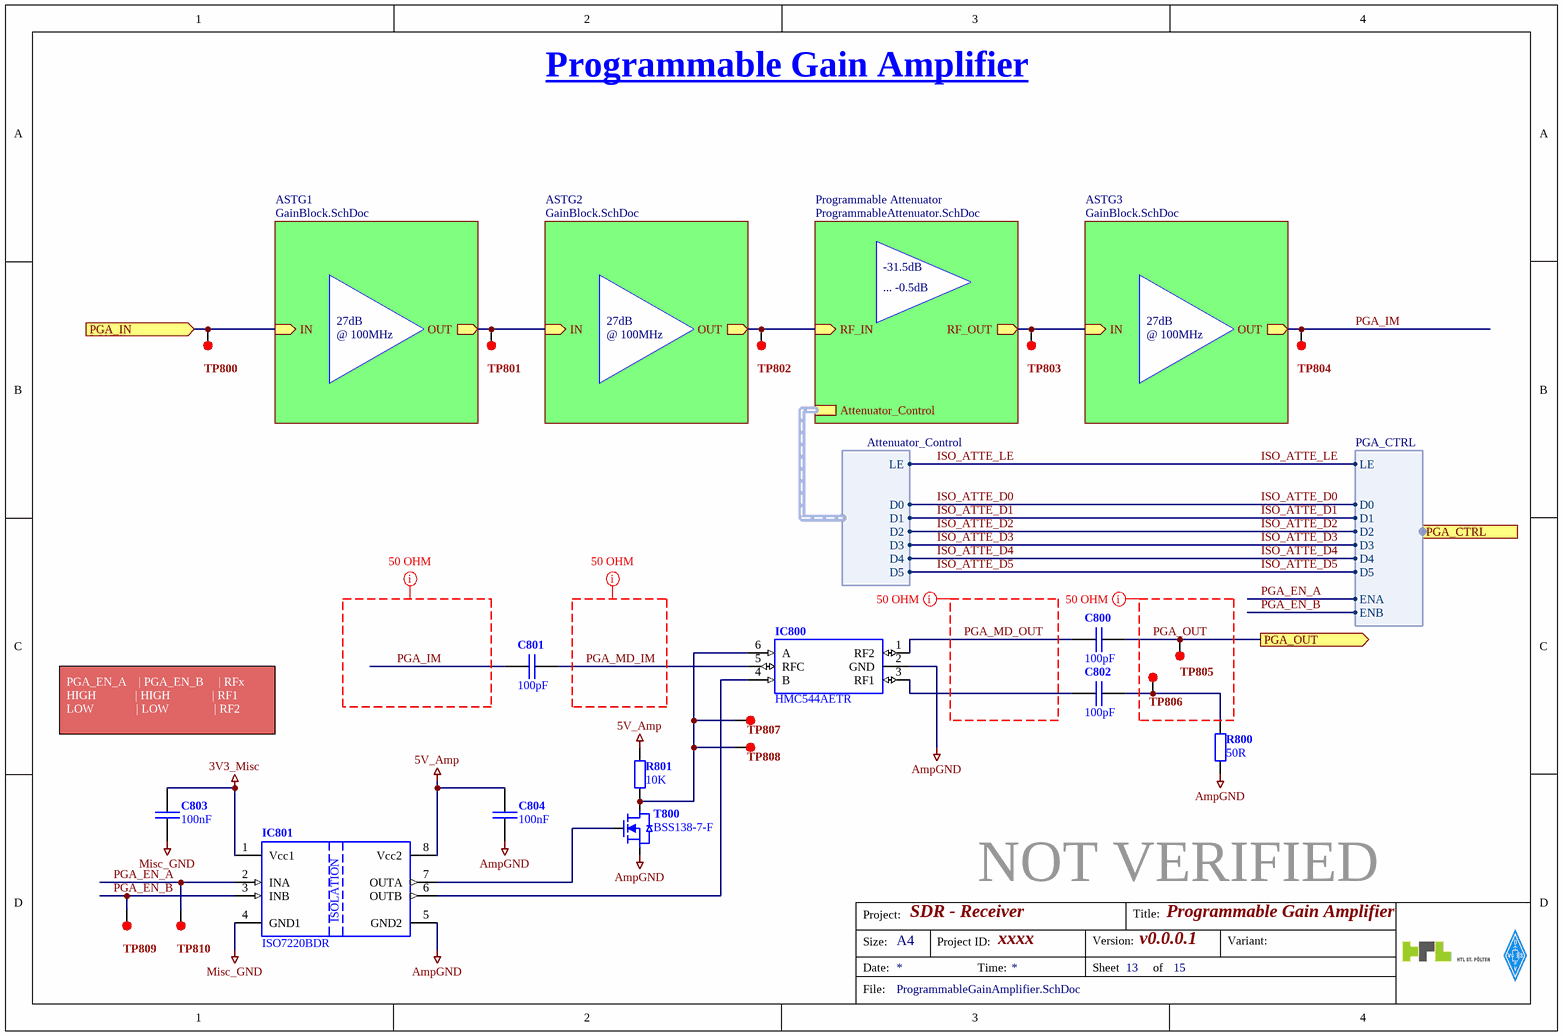
[diagram p11: ProgrammableGainAmplifier.SchDoc]

### Parts
C800  100pF  [C_0603_N [CAPC1608N IPC]]
C801  100pF  [C_0603_N [CAPC1608N IPC]]
C802  100pF  [C_0603_N [CAPC1608N IPC]]
C803  100nF  [C_0603_N [CAPC1608N IPC]]
C804  100nF  [C_0603_N [CAPC1608N IPC]]
IC800  HMC544AETR  [TSOP95P280X145-6N IPC]
IC801  ISO7220BDR  [SOIC127P600X175-8N IPC]
R800  50R  [R_1206_N [RESC3216N IPC]]
R801  10K  [R_0603_N [RESC1608N IPC]]
T800  BSS138-7-F  [SOT105P235X102-3N IPC]
TP800  TP_GENERIC  [TP_0.8_P100T]  (value not drawn)  (no BOM)
TP801  TP_GENERIC  [TP_0.8_P100T]  (value not drawn)  (no BOM)
TP802  TP_GENERIC  [TP_0.8_P100T]  (value not drawn)  (no BOM)
TP803  TP_GENERIC  [TP_0.8_P100T]  (value not drawn)  (no BOM)
TP804  TP_GENERIC  [TP_0.8_P100T]  (value not drawn)  (no BOM)
TP805  TP_GENERIC  [TP_0.8_P100T]  (value not drawn)  (no BOM)
TP806  TP_GENERIC  [TP_0.8_P100T]  (value not drawn)  (no BOM)
TP807  TP_GENERIC  [TP_0.8_P100T]  (value not drawn)  (no BOM)
TP808  TP_GENERIC  [TP_0.8_P100T]  (value not drawn)  (no BOM)
TP809  TP_GENERIC  [TP_0.8_P100T]  (value not drawn)  (no BOM)
TP810  TP_GENERIC  [TP_0.8_P100T]  (value not drawn)  (no BOM)

### Sub-sheets
ASTG1 = GainBlock.SchDoc: OUT (out), IN (in)
ASTG2 = GainBlock.SchDoc: OUT (out), IN (in)
ASTG3 = GainBlock.SchDoc: OUT (out), IN (in)
Programmable Attenuator = ProgrammableAttenuator.SchDoc: RF_IN (in), RF_OUT (out), Attenuator_Control (harness Attenuator_Control)

### Ports
PGA_CTRL (harness PGA_CTRL), PGA_IN (in), PGA_OUT (out)

### Harnesses
Attenuator_Control: LE, D0, D1, D2, D3, D4, D5
PGA_CTRL: LE, D0, D1, D2, D3, D4, D5, ENA, ENB

### Nets
3V3_Misc: C803.1 IC801.1(Vcc1)
5V_Amp: C804.1 IC801.8(Vcc2) R801.2
AmpGND: C804.2 IC800.2(GND) IC801.5(GND2) R800.1 T800.S
Misc_GND: C803.2 IC801.4(GND1)  [project net Con_GND]
ISO_ATTE_D0: sheet Programmable Attenuator/Attenuator_Control.D0, port PGA_CTRL.D0
ISO_ATTE_D1: sheet Programmable Attenuator/Attenuator_Control.D1, port PGA_CTRL.D1
ISO_ATTE_D2: sheet Programmable Attenuator/Attenuator_Control.D2, port PGA_CTRL.D2
ISO_ATTE_D3: sheet Programmable Attenuator/Attenuator_Control.D3, port PGA_CTRL.D3
ISO_ATTE_D4: sheet Programmable Attenuator/Attenuator_Control.D4, port PGA_CTRL.D4
ISO_ATTE_D5: sheet Programmable Attenuator/Attenuator_Control.D5, port PGA_CTRL.D5
ISO_ATTE_LE: sheet Programmable Attenuator/Attenuator_Control.LE, port PGA_CTRL.LE
PGA_EN_A: IC801.2(INA) TP810.1 ; port PGA_CTRL.ENA
PGA_EN_B: IC801.3(INB) TP809.1 ; port PGA_CTRL.ENB
PGA_IM: C801.1 TP804.1 ; sheet ASTG3/OUT
PGA_MD_IM: C801.2 IC800.5(RFC)
PGA_MD_OUT: C800.1 IC800.1(RF2)
PGA_OUT: C800.2 TP805.1 ; port PGA_OUT
NetC802_1: C802.1 IC800.3(RF1)
NetC802_2: C802.2 R800.2 TP806.1
NetIC800_4: IC800.4(B) IC801.6(OUTB)
NetIC800_6: IC800.6(A) R801.1 T800.D TP807.1 TP808.1
NetIC801_7: IC801.7(OUTA) T800.G
NetTP800_1: TP800.1 ; port PGA_IN, sheet ASTG1/IN
NetTP801_1: TP801.1 ; sheet ASTG1/OUT, sheet ASTG2/IN
NetTP802_1: TP802.1 ; sheet ASTG2/OUT, sheet Programmable Attenuator/RF_IN
NetTP803_1: TP803.1 ; sheet ASTG3/IN, sheet Programmable Attenuator/RF_OUT

### Layout directives
rule Width Constraint [Pref Impedance = 50.00ohms    Min Impedance = 50.00ohms    Max Impedance = 50.00ohms]; rule Maximum Via Count Constraint [Max Count = 2]: PGA_IM, PGA_MD_IM, PGA_MD_OUT, PGA_OUT

### Notes on the sheet
- -31.5dB
- ... -0.5dB
- 27dB
- @ 100MHz
- PGA_EN_A    | PGA_EN_B     | RFx
  HIGH             | HIGH              | RF1
  LOW              | LOW               | RF2
- Project:
- Title:
- Size:
- Date:
- A4
- Project ID:
- Time:
- Sheet
- Version:
- of
- Variant:
- File:
- (in symbol IC_ISO7220BDR) ISOLATION

### Library data of the parts
C800-C802 = C_GENERIC: Prometheus_Manufacturer: AVX Corporation; Prometheus_ID: *; Prometheus_ManPartNo: =06031U101FAT2A; Prometheus_Comment: 100pF; Prometheus_CurrentFootprint: C_0603_N [CAPC1608N IPC]
C803 C804 = C_GENERIC: Prometheus_ID: *; Prometheus_ManPartNo: 100nF; Prometheus_Manufacturer: *; Prometheus_Comment: 100nF; Prometheus_CurrentFootprint: C_0603_N [CAPC1608N IPC]
IC800 = IC_HMC544AETR: GaAS MMIC T/R Switch / DC ... 4 GHz / Insetion Loss: 0.2 dB @ 1 GHz / P1dB: +39 dBm / IP3: +60 dBm / Control: 3 V / 5 V; Prometheus_Manufacturer: Analog Devices; Prometheus_ManPartNo: HMC544AETR; Prometheus_Comment: HMC544AETR; Prometheus_CurrentFootprint: TSOP95P280X145-6N IPC; DatasheetURL: https://www.analog.com/media/en/technical-documentation/data-sheets/hmc544ae.pdf
IC801 = IC_ISO7220BDR: Dual-Channel Digital Isolator / Vcc: 3V3 or 5 V Supply / 4 kV ESD protection; Prometheus_Manufacturer: Texas Instruments; Prometheus_ManPartNo: ISO7220BDR; Prometheus_Comment: ISO7220BDR; Prometheus_CurrentFootprint: SOIC127P600X175-8N IPC; DatasheetURL: https://www.ti.com/lit/ds/symlink/iso7220a.pdf
R800 R801 = R_GENERIC_DIN: Prometheus_ID: *; Prometheus_Manufacturer: *
  R800: Prometheus_ManPartNo: 50R; Prometheus_Comment: 50R; Prometheus_CurrentFootprint: R_1206_N [RESC3216N IPC]
  R801: Prometheus_ManPartNo: 10K; Prometheus_Comment: 10K; Prometheus_CurrentFootprint: R_0603_N [RESC1608N IPC]
T800 = T_NMOS_BSS138-7-F: as T500 on sheet UART_JTAG; Prometheus_ID: *; Prometheus_ManPartNo: BSS138-7-F; Prometheus_Comment: BSS138-7-F; Prometheus_CurrentFootprint: SOT105P235X102-3N IPC; ComponentLink1Description: Datasheet; ComponentLink1URL: https://www.diodes.com/assets/Datasheets/ds30144.pdf
TP800-TP810 = TP_GENERIC: Needle Test Point; Prometheus_ID: *; Prometheus_ManPartNo: TP_GENERIC; Prometheus_Manufacturer: *; Prometheus_Comment: TP_GENERIC; Prometheus_CurrentFootprint: TP_0.8_P100T

## Sheet GainBlock.SchDoc: Gain Block
size A4; DrawnBy: Patrik Staudenmayer; DocumentNumber: 14; SheetNumber: 14; SheetTotal: 15
Used 3 times, as channels Overview/HF Front End/Programmable Gain Amplifier/ASTG1, Overview/HF Front End/Programmable Gain Amplifier/ASTG2, Overview/HF Front End/Programmable Gain Amplifier/ASTG3. Parts and nets are listed once, with the designators drawn on the sheet.
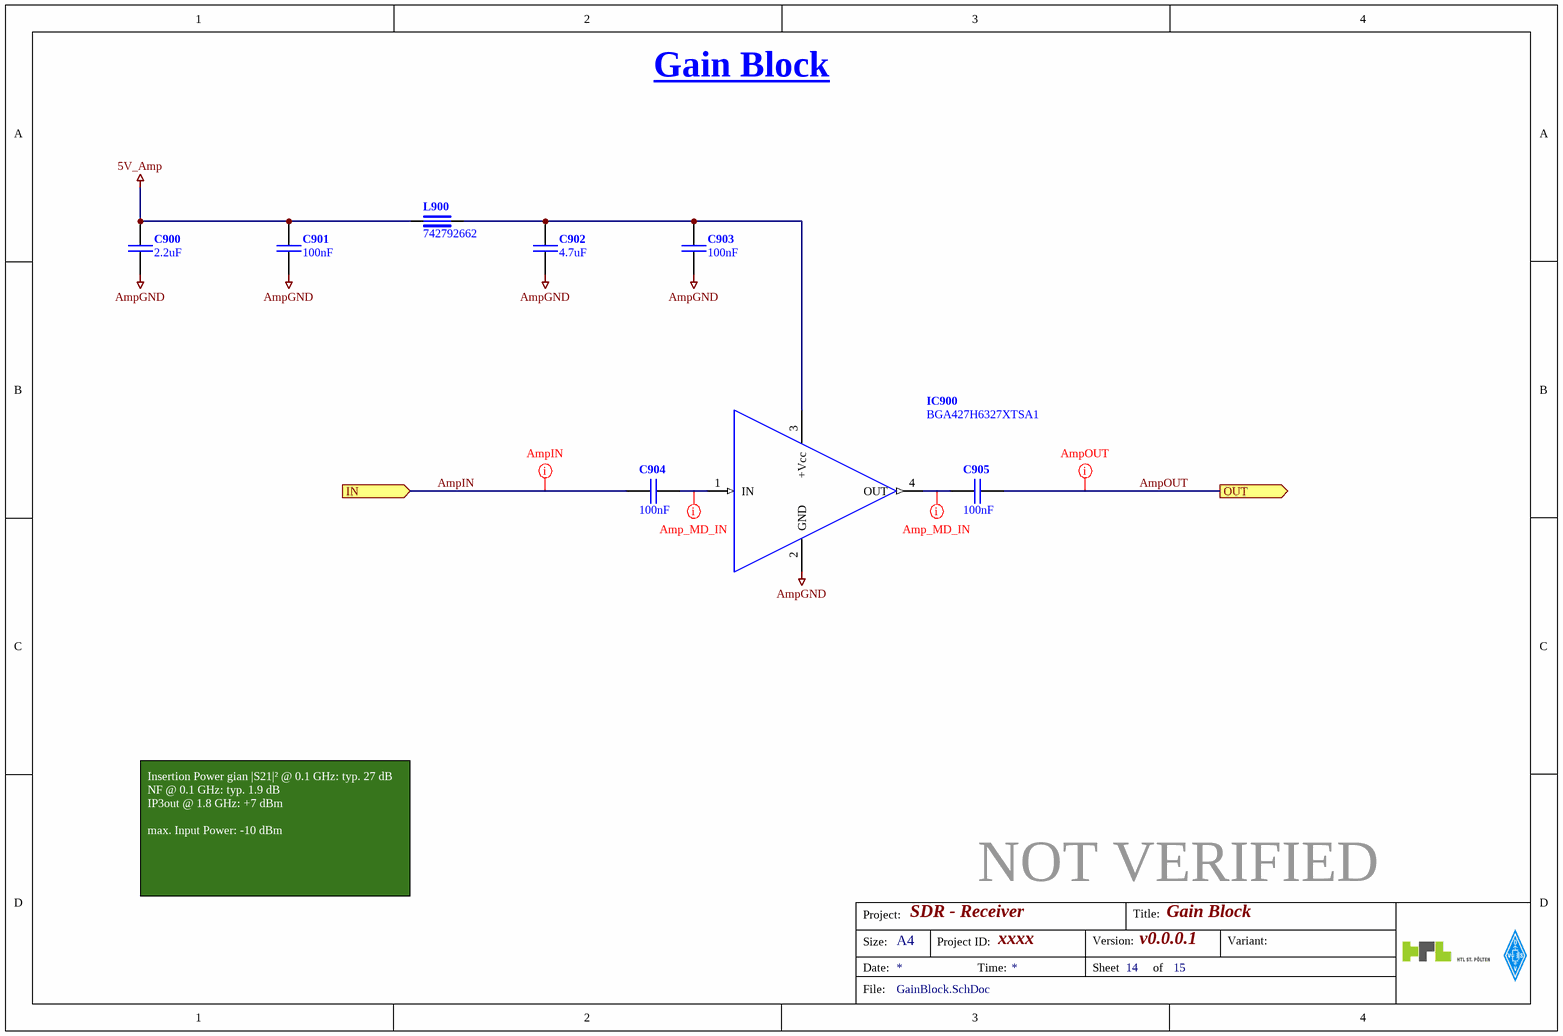
[diagram p12: GainBlock.SchDoc]

### Parts
C900  2.2uF  [C_0805_N [CAPC2013N IPC]]
C901  100nF  [C_0603_N [CAPC1608N IPC]]
C902  4.7uF  [C_0805_N [CAPC2013N IPC]]
C903  100nF  [C_0603_N [CAPC1608N IPC]]
C904  100nF  [C_0603_N [CAPC1608N IPC]]
C905  100nF  [C_0603_N [CAPC1608N IPC]]
IC900  BGA427H6327XTSA1  [SOT130P210X100-4N IPC]
L900  742792662  [L_0603_N [INDC1608N IPC]]

### Ports
IN (in), OUT (out)

### Nets
5V_Amp: C900.1 C901.1 L900.2
AmpGND: C900.2 C901.2 C902.2 C903.2 IC900.2(GND)
AmpIN: C904.2 ; port IN
AmpOUT: C905.1 ; port OUT
NetC902_1: C902.1 C903.1 IC900.3(+Vcc) L900.1
NetC904_1: C904.1 IC900.1(IN)
NetC905_2: C905.2 IC900.4(OUT)

### Channels
Overview/HF Front End/Programmable Gain Amplifier/ASTG1: designators end in _ASTG1; ports IN=AmpIN OUT=AmpOUT
Overview/HF Front End/Programmable Gain Amplifier/ASTG2: designators end in _ASTG2; ports IN=AmpIN OUT=AmpOUT
Overview/HF Front End/Programmable Gain Amplifier/ASTG3: designators end in _ASTG3; ports IN=AmpIN OUT=AmpOUT

### Layout directives
rule Width Constraint [Pref Impedance = 50.00ohms    Min Impedance = 50.00ohms    Max Impedance = 50.00ohms]: AmpIN, AmpOUT, NetC904_ASTG1_1, NetC905_ASTG1_2

### Notes on the sheet
- Gain Block
- Insertion Power gian |S21|² @ 0.1 GHz: typ. 27 dB
  NF @ 0.1 GHz: typ. 1.9 dB
  IP3out @ 1.8 GHz: +7 dBm
  max. Input Power: -10 dBm
- Project:
- Title:
- Size:
- Date:
- A4
- Project ID:
- Time:
- Sheet
- Version:
- of
- Variant:
- File:

### Library data of the parts
C900-C903 = C_GENERIC: Prometheus_ID: *; Prometheus_Manufacturer: *
  C900: Prometheus_ManPartNo: 2.2uF; Prometheus_Comment: 2.2uF; Prometheus_CurrentFootprint: C_0805_N [CAPC2013N IPC]
  C901 C903: Prometheus_ManPartNo: 100nF; Prometheus_Comment: 100nF; Prometheus_CurrentFootprint: C_0603_N [CAPC1608N IPC]
  C902: Prometheus_ManPartNo: 4.7uF; Prometheus_Comment: 4.7uF; Prometheus_CurrentFootprint: C_0805_N [CAPC2013N IPC]
C904 C905 = C_GENERIC: Prometheus_ManPartNo: 06031U101FAT2A; Prometheus_Manufacturer: AVX Corporation; Prometheus_ID: *; Prometheus_Comment: 100nF; Prometheus_CurrentFootprint: C_0603_N [CAPC1608N IPC]
IC900 = IC_BGA427: Si-MMIC-Amplifier in SIEGET® 25-Technologie / Cascadeable 50 OHM gain block / NF = 2.2 dB @ 1.8 GHz / IP3out = + 7 dBm @ 1.8 GHz (Vd = 3V, Id = 9.4 mA) / Vc = 2 V to  5V; Prometheus_Manufacturer: Infineon Technologies; Prometheus_ManPartNo: BGA427H6327XTSA1; Prometheus_Comment: BGA427H6327XTSA1; Prometheus_CurrentFootprint: SOT130P210X100-4N IPC
L900 = FB_GENERIC: Prometheus_Manufacturer: Wuerth Electronics; Prometheus_ID: *; Prometheus_ManPartNo: 742792662; Prometheus_Comment: 742792662; Prometheus_CurrentFootprint: L_0603_N [INDC1608N IPC]

## Sheet ProgrammableAttenuator.SchDoc: Programmable Attenuator
size A4; DrawnBy: Patrik Staudenmayer; DocumentNumber: 15; SheetNumber: 15; SheetTotal: 15
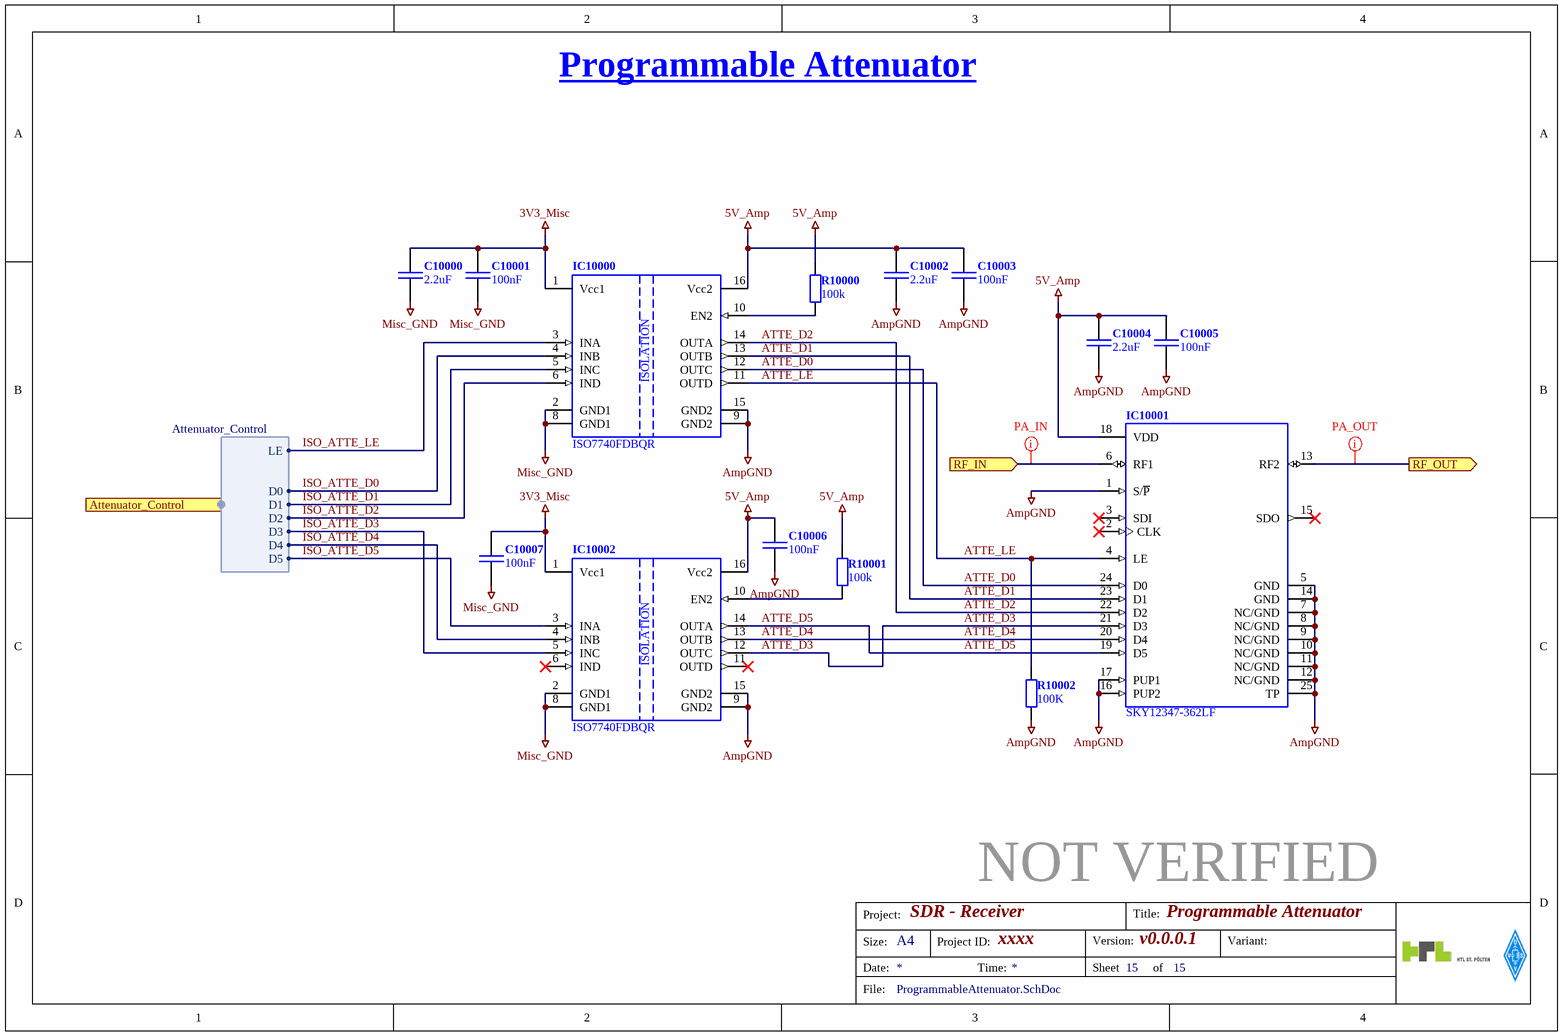
[diagram p13: ProgrammableAttenuator.SchDoc]

### Parts
C10000  2.2uF  [C_0805_N [CAPC2013N IPC]]
C10001  100nF  [C_0603_N [CAPC1608N IPC]]
C10002  2.2uF  [C_0805_N [CAPC2013N IPC]]
C10003  100nF  [C_0603_N [CAPC1608N IPC]]
C10004  2.2uF  [C_0805_N [CAPC2013N IPC]]
C10005  100nF  [C_0603_N [CAPC1608N IPC]]
C10006  100nF  [C_0603_N [CAPC1608N IPC]]
C10007  100nF  [C_0603_N [CAPC1608N IPC]]
IC10000  ISO7740FDBQR  [SOP64P600X175-16N IPC]
IC10001  SKY12347-362LF  [QFN50P400X400X100_HS-25N IPC]
IC10002  ISO7740FDBQR  [SOP64P600X175-16N IPC]
R10000  100k  [R_0603_N [RESC1608N IPC]]
R10001  100k  [R_0603_N [RESC1608N IPC]]
R10002  100K  [R_0603_N [RESC1608N IPC]]

### Ports
Attenuator_Control (out, harness Attenuator_Control), RF_IN (in), RF_OUT (out)

### Harnesses
Attenuator_Control: LE, D0, D1, D2, D3, D4, D5

### Nets
3V3_Misc: C10000.1 C10001.1 C10007.1 IC10000.1(Vcc1) IC10002.1(Vcc1)
5V_Amp: C10002.1 C10003.1 C10004.1 C10005.1 C10006.1 IC10000.16(Vcc2) IC10001.18(VDD) IC10002.16(Vcc2) R10000.2 R10001.2
AmpGND: C10002.2 C10003.2 C10004.2 C10005.2 C10006.2 IC10000.9(GND2) IC10000.15(GND2) IC10001.1(S/~{P}) IC10001.5(GND) IC10001.7(NC/GND) IC10001.8(NC/GND) IC10001.9(NC/GND) IC10001.10(NC/GND) IC10001.11(NC/GND) IC10001.12(NC/GND) IC10001.14(GND) IC10001.16(PUP2) IC10001.17(PUP1) IC10001.25(TP) IC10002.9(GND2) IC10002.15(GND2) R10002.1
Misc_GND: C10000.2 C10001.2 C10007.2 IC10000.2(GND1) IC10000.8(GND1) IC10002.2(GND1) IC10002.8(GND1)  [project net Con_GND]
ATTE_D0: IC10000.12(OUTC) IC10001.24(D0)
ATTE_D1: IC10000.13(OUTB) IC10001.23(D1)
ATTE_D2: IC10000.14(OUTA) IC10001.22(D2)
ATTE_D3: IC10001.21(D3) IC10002.12(OUTC)
ATTE_D4: IC10001.20(D4) IC10002.13(OUTB)
ATTE_D5: IC10001.19(D5) IC10002.14(OUTA)
ATTE_LE: IC10000.11(OUTD) IC10001.4(LE) R10002.2
ISO_ATTE_D0: IC10000.4(INB) ; port Attenuator_Control.D0
ISO_ATTE_D1: IC10000.5(INC) ; port Attenuator_Control.D1
ISO_ATTE_D2: IC10000.6(IND) ; port Attenuator_Control.D2
ISO_ATTE_D3: IC10002.5(INC) ; port Attenuator_Control.D3
ISO_ATTE_D4: IC10002.4(INB) ; port Attenuator_Control.D4
ISO_ATTE_D5: IC10002.3(INA) ; port Attenuator_Control.D5
ISO_ATTE_LE: IC10000.3(INA) ; port Attenuator_Control.LE
NetIC10000_10: IC10000.10(EN2) R10000.1
NetIC10001_6: IC10001.6(RF1) ; port RF_IN
NetIC10001_13: IC10001.13(RF2) ; port RF_OUT
NetIC10002_10: IC10002.10(EN2) R10001.1

Not connected (* = marked no-connect by the designer): IC10001 2(CLK)* 3(SDI)* 15(SDO)*; IC10002 6(IND)* 11(OUTD)*

### Layout directives
rule Width Constraint [Pref Impedance = 50.00ohms    Min Impedance = 50.00ohms    Max Impedance = 50.00ohms]: NetIC10001_6, NetIC10001_13

### Notes on the sheet
- Programmable Attenuator
- Project:
- Title:
- Size:
- Date:
- A4
- Project ID:
- Time:
- Sheet
- Version:
- of
- Variant:
- File:
- (in symbol IC_ISO7740FDBQR) ISOLATION

### Library data of the parts
C10000-C10007 = C_GENERIC: Prometheus_ID: *; Prometheus_Manufacturer: *
  C10000 C10002 C10004: Prometheus_ManPartNo: 2.2uF; Prometheus_Comment: 2.2uF; Prometheus_CurrentFootprint: C_0805_N [CAPC2013N IPC]
  C10001 C10003 C10005-C10007: Prometheus_ManPartNo: 100nF; Prometheus_Comment: 100nF; Prometheus_CurrentFootprint: C_0603_N [CAPC1608N IPC]
IC10000 IC10002 = IC_ISO7740FDBQR: High-Speed, Robust-EMC Reinforced Quad-Channel Digital Isolators / 100 Mbps data rate / Vcc: 2.25 V ... 5.5 V / 2.25 V to 5.5 V level translation; Prometheus_Manufacturer: Texas Instruments; Prometheus_ManPartNo: ISO7740FDBQR; Prometheus_Comment: ISO7740FDBQR; Prometheus_CurrentFootprint: SOP64P600X175-16N IPC; DatasheetURL: https://www.ti.com/lit/ds/symlink/iso7742.pdf
IC10001 = IC_SKY12347-362LF: Six-Bit Digital Attenuator / Attenuation: 0.5 dB ... 31.5 dB / Serial or Parallel Driver; Prometheus_Manufacturer: Skyworks; Prometheus_ManPartNo: SKY12347-362LF; Prometheus_Comment: SKY12347-362LF; Prometheus_CurrentFootprint: QFN50P400X400X100_HS-25N IPC; DatasheetURL: https://www.skyworksinc.com/-/media/SkyWorks/Documents/Products/501-600/201371B.pdf
R10000-R10002 = R_GENERIC_DIN: Prometheus_ID: *; Prometheus_Manufacturer: *; Prometheus_CurrentFootprint: R_0603_N [RESC1608N IPC]
  R10000 R10001: Prometheus_ManPartNo: 100k; Prometheus_Comment: 100k
  R10002: Prometheus_ManPartNo: 100K; Prometheus_Comment: 100K